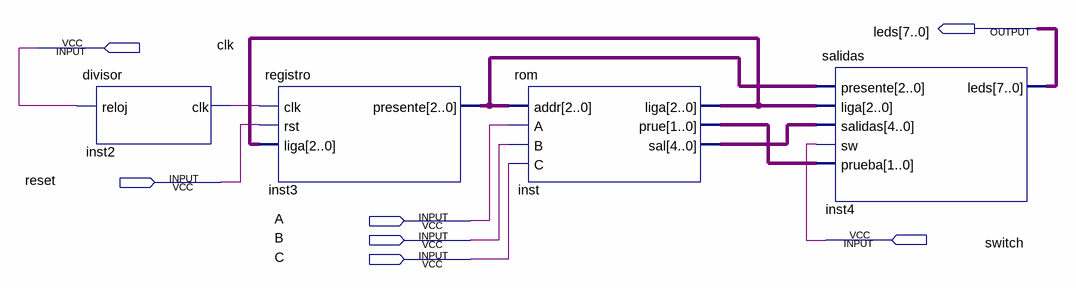
[diagram p0: schematic sheet]
// Quartus schematic prac4.bdf as structural Verilog: 4 symbols, 7 pins
module prac4 (
  input  clk,
  input  reset,
  input  A,
  input  B,
  input  switch,
  input  C,
  output [7:0] leds
);

  wire inst2_clk;
  wire [1:0] inst_prue;
  wire [2:0] inst3_presente, inst_liga;
  wire [4:0] inst_sal;

  divisor inst2 (.reloj(clk), .clk(inst2_clk));
  registro inst3 (.clk(inst2_clk), .rst(reset), .liga(inst_liga), .presente(inst3_presente));
  rom inst (.addr(inst3_presente), .A(A), .B(B), .C(C), .liga(inst_liga), .prue(inst_prue), .sal(inst_sal));
  salidas inst4 (
    .presente(inst3_presente), .liga(inst_liga), .salidas(inst_sal), .sw(switch), .prueba(inst_prue),
    .leds(leds));
endmodule
